# Altium schematic sheet main_4.SchDoc: main
size 282 x 200 mm; Date: 9/25/2019 7:26:12 PM; SheetNumber: 5; CNAME: RJ Cunningham; GateName_1: G$1; SymbolName_1: A4L-LOC; LibraryName: frames; DeviceSetName: A4L-LOC
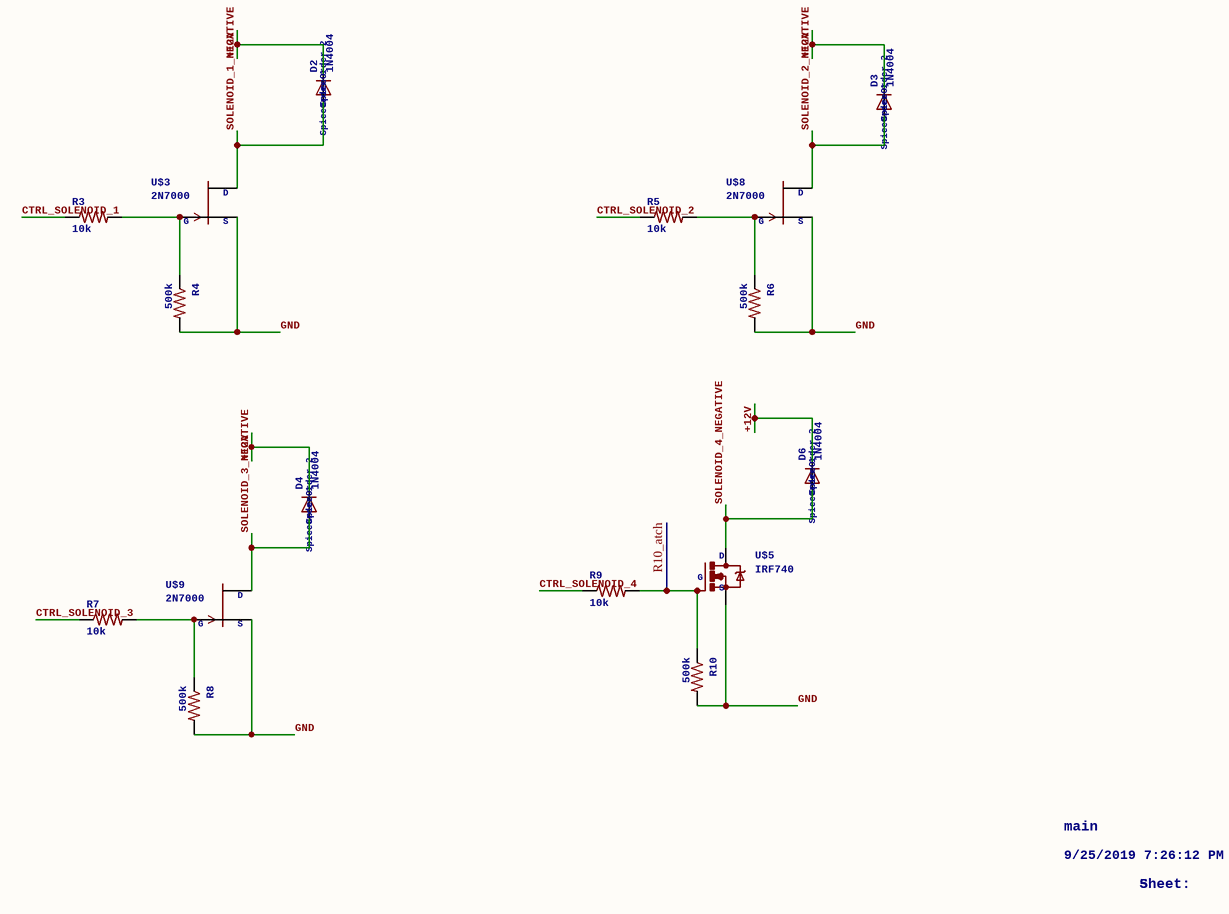
[diagram p0: main_4.SchDoc]

## Parts
D2  1N4004  SpiceOrder1: SpiceOrder 1  SpiceOrder2: SpiceOrder 2  [DO41-10]
D3  1N4004  SpiceOrder1: SpiceOrder 1  SpiceOrder2: SpiceOrder 2  [DO41-10]
D4  1N4004  SpiceOrder1: SpiceOrder 1  SpiceOrder2: SpiceOrder 2  [DO41-10]
D6  1N4004  SpiceOrder1: SpiceOrder 1  SpiceOrder2: SpiceOrder 2  [DO41-10]
R3  10k  [R0805]
R4  500k  [R0805]
R5  10k  [R0805]
R6  500k  [R0805]
R7  10k  [R0805]
R8  500k  [R0805]
R9  10k  [R0805]
R10  500k  [R0805]
U$3  2N7000  [SOT23]
U$5  IRF740  [TO220BV]
U$8  2N7000  [SOT23]
U$9  2N7000  [SOT23]

## Nets
+12V: D2.C D3.C D4.C D6.C
CTRL_SOLENOID_1: R3.1
CTRL_SOLENOID_2: R5.1
CTRL_SOLENOID_3: R7.1
CTRL_SOLENOID_4: R9.1
GND: R4.2 R6.2 R8.2 R10.2 U$3.2(S) U$5.S U$8.2(S) U$9.2(S)
R10_atch: R9.2 R10.1 U$5.G
SOLENOID_1_NEGATIVE: D2.A U$3.3(D)
SOLENOID_2_NEGATIVE: D3.A U$8.3(D)
SOLENOID_3_NEGATIVE: D4.A U$9.3(D)
SOLENOID_4_NEGATIVE: D6.A U$5.D
NetR3_2: R3.2 R4.1 U$3.1(G)
NetR5_2: R5.2 R6.1 U$8.1(G)
NetR7_2: R7.2 R8.1 U$9.1(G)

## Notes on the sheet
- main
- 9/25/2019 7:26:12 PM
- 5
- Sheet:
- 1
- 2
- 3
- 4
- 6
- A
- B
- C
- D

## Library data of the parts
D2-D4 D6 = 1N4004: DIODEgeneral purpose rectifier, 1 A; GateName_1: 1; SymbolName_1: D; LibraryName: diode; DeviceSetName: 1N4004
R3-R10 = R-US_R0805: RESISTOR, American symbol; GateName_1: G$1; SymbolName_1: R-US; DeviceSetName: R-US_; DeviceName: R0805; LibraryName: rcl
U$3 U$8 U$9 = 2N7000: GateName_1: G$1; SymbolName_1: JFET-N; LibraryName: transistor-fet-extra; DeviceSetName: 2N7000; D: D; S: S; G: G
U$5 = IRF740: N-CHANNEL MOS FET; GateName_1: G$1; SymbolName_1: MFNS; LibraryName: transistor-power; DeviceSetName: IRF740; D: D; S: S; G: G